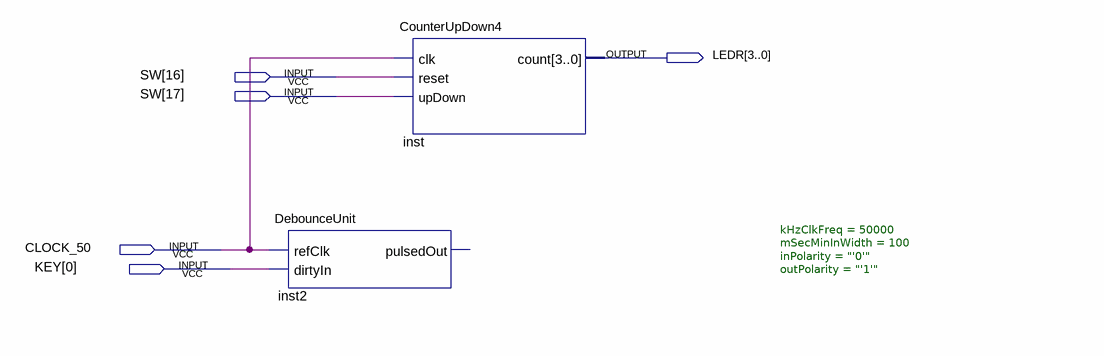
[diagram p0: schematic sheet]
// Quartus schematic Counter_Demo.bdf as structural Verilog: 2 symbols, 5 pins
module Counter_Demo (
  input  [17:16] SW,
  input  CLOCK_50,
  input  [0:0] KEY,
  output [3:0] LEDR
);

  DebounceUnit #(.kHzClkFreq(50000), .mSecMinInWidth(100), .inPolarity("'0'"), .outPolarity("'1'")) inst2 (
    .refClk(CLOCK_50), .dirtyIn(KEY[0]));  // open: pulsedOut
  CounterUpDown4 inst (.clk(CLOCK_50), .reset(SW[16]), .upDown(SW[17]), .count(LEDR));
endmodule
